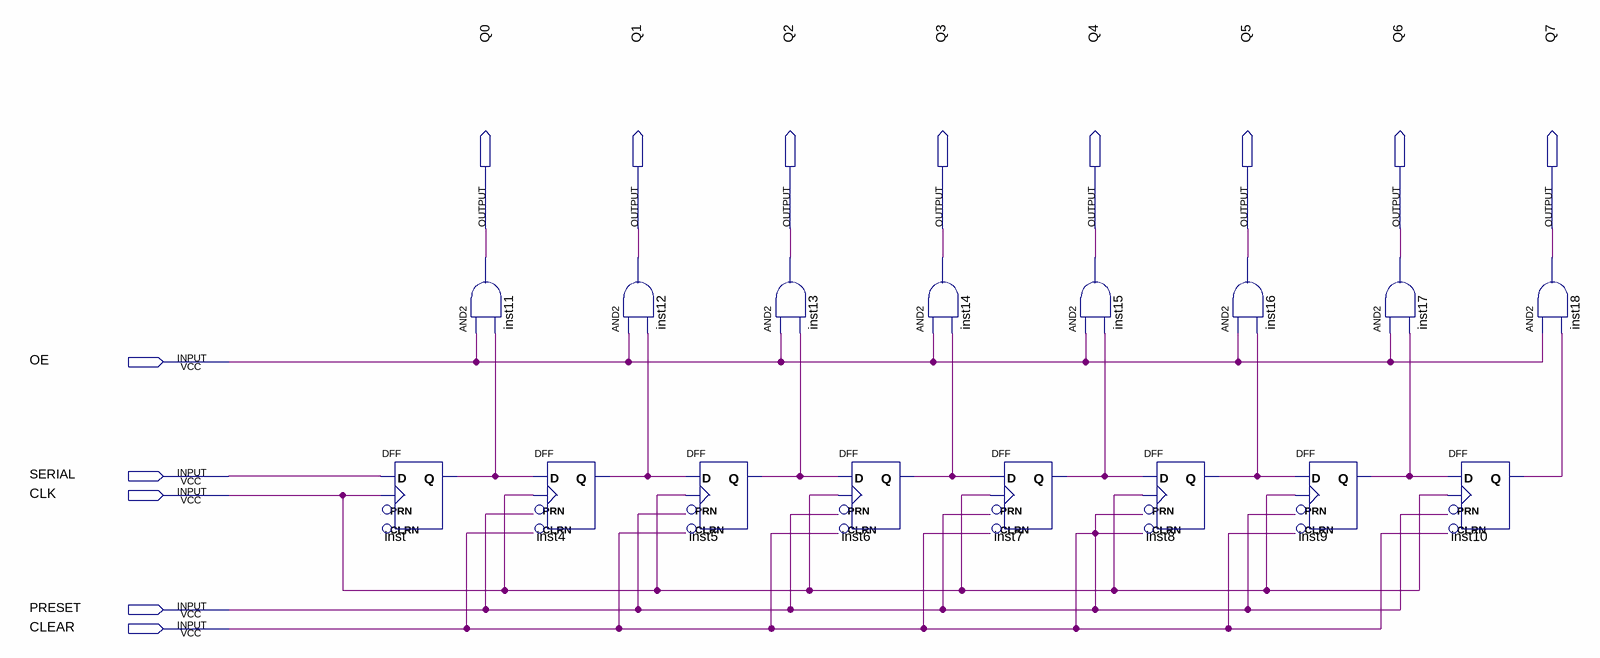
[diagram p0: schematic sheet]
// Quartus schematic SIPO8Bits.bdf as structural Verilog: 16 symbols, 13 pins
module SIPO8Bits (
  input  OE,
  input  SERIAL,
  input  CLK,
  input  PRESET,
  input  CLEAR,
  output Q0,
  output Q1,
  output Q2,
  output Q3,
  output Q4,
  output Q5,
  output Q6,
  output Q7
);

  wire inst4_q, inst5_q, inst6_q, inst7_q, inst8_q, inst9_q, inst10_q, inst_q;

  DFF inst (.CLK(CLK), .D(SERIAL), .Q(inst_q));  // open: CLRN, PRN
  and inst11 (Q0, OE, inst_q);
  DFF inst4 (.CLRN(CLEAR), .CLK(CLK), .D(inst_q), .PRN(CLEAR), .Q(inst4_q));
  and inst12 (Q1, OE, inst4_q);
  DFF inst5 (.CLRN(CLEAR), .CLK(CLK), .D(inst4_q), .PRN(CLEAR), .Q(inst5_q));
  and inst13 (Q2, OE, inst5_q);
  DFF inst6 (.CLRN(CLEAR), .CLK(CLK), .D(inst5_q), .PRN(CLEAR), .Q(inst6_q));
  and inst14 (Q3, OE, inst6_q);
  DFF inst7 (.CLRN(CLEAR), .CLK(CLK), .D(inst6_q), .PRN(CLEAR), .Q(inst7_q));
  and inst15 (Q4, OE, inst7_q);
  DFF inst8 (.CLRN(CLEAR), .CLK(CLK), .D(inst7_q), .PRN(CLEAR), .Q(inst8_q));
  and inst16 (Q5, OE, inst8_q);
  DFF inst9 (.CLRN(CLEAR), .CLK(CLK), .D(inst8_q), .PRN(CLEAR), .Q(inst9_q));
  and inst17 (Q6, OE, inst9_q);
  DFF inst10 (.CLRN(CLEAR), .CLK(CLK), .D(inst9_q), .PRN(CLEAR), .Q(inst10_q));
  and inst18 (Q7, OE, inst10_q);

  assign PRESET = CLEAR;
endmodule
